# EAGLE design ME433 (EAGLE 9.6.2)
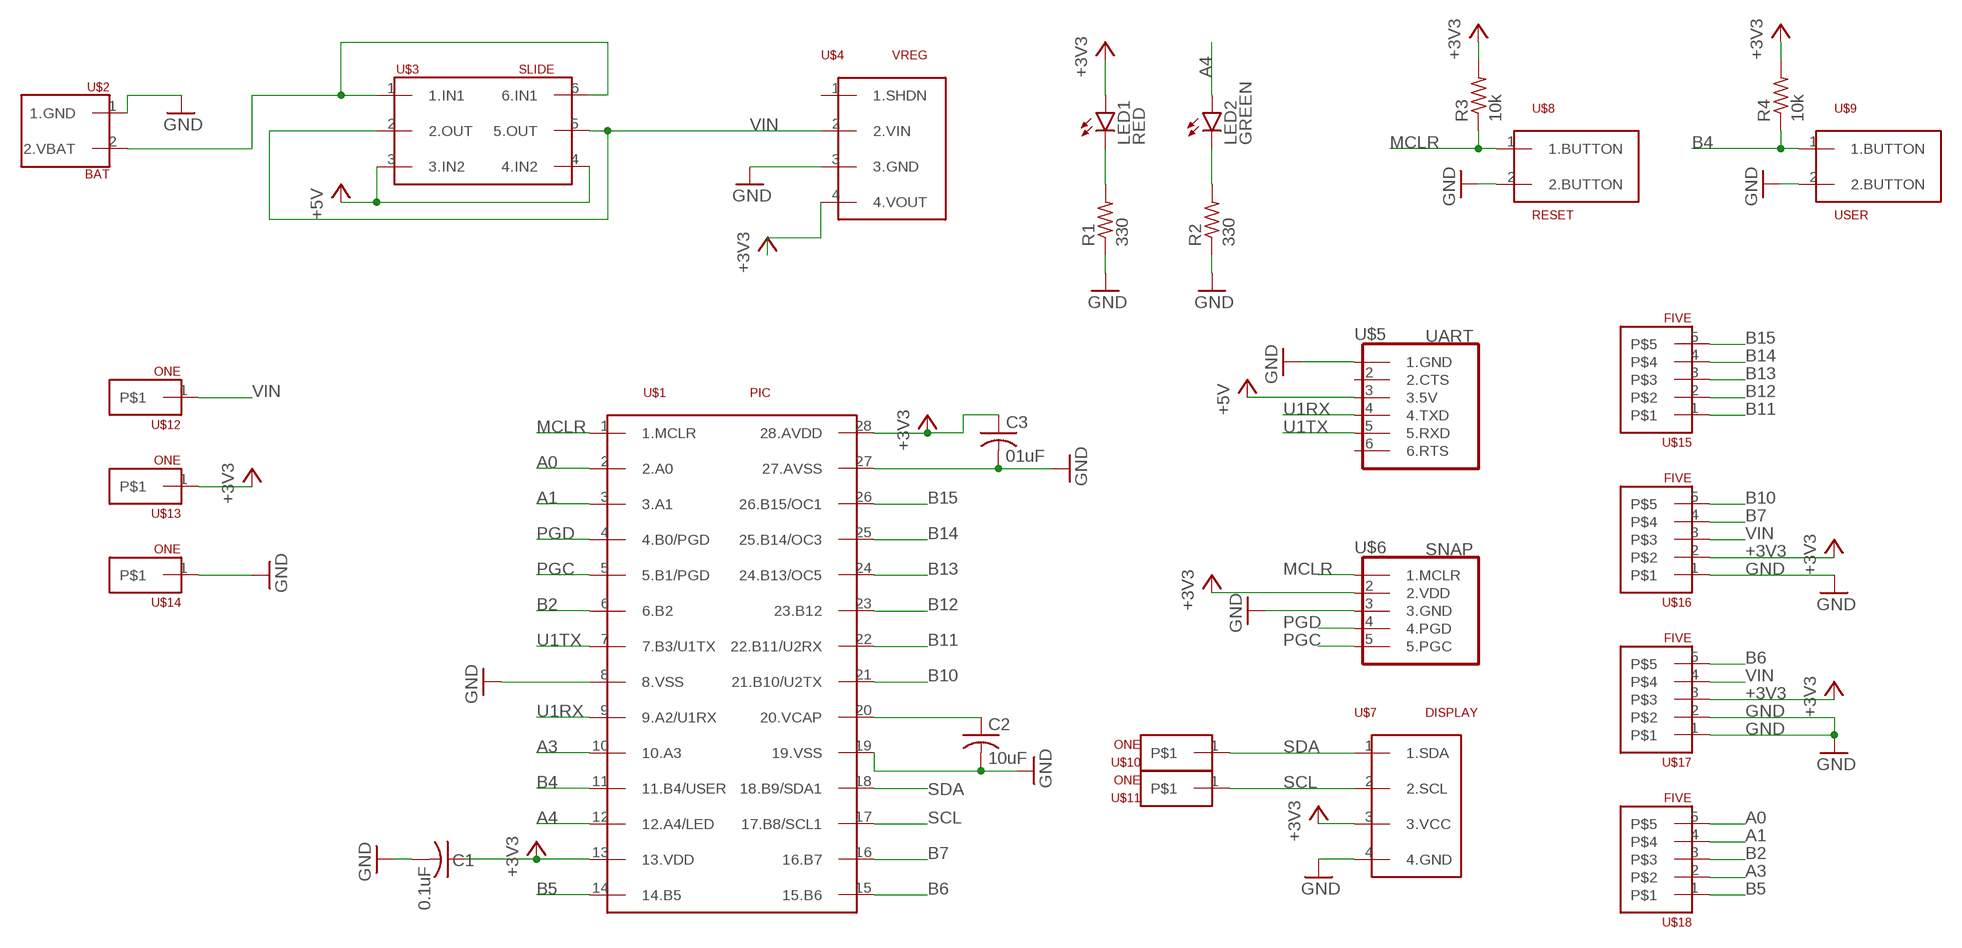
[diagram p0: schematic, sheet 1]

## Parts
C1  0.1uF  C-US025-024X044  [C025-024X044]
C2  10uF  C-US025-024X044  [C025-024X044]
C3  01uF  C-US025-024X044  [C025-024X044]
LED1  RED  LED3MM  [LED3MM]
LED2  GREEN  LED3MM  [LED3MM]
R1  330  R-US_0207/7  [0207/7]
R2  330  R-US_0207/7  [0207/7]
R3  10k  R-US_0207/7  [0207/7]
R4  10k  R-US_0207/7  [0207/7]
U$1  PIC  [DIL28-3]
U$2  BAT  [BAT]
U$3  SLIDE  [SLIDE]
U$4  VREG  [VREG]
U$5  UART  [UART]
U$6  SNAP  [SNAP]
U$7  DISPLAY  [DISPLAY]
U$8  RESET  BUTTON  [BUTTON]
U$9  USER  BUTTON  [BUTTON]
U$10  ONE  [ONE]
U$11  ONE  [ONE]
U$12  ONE  [ONE]
U$13  ONE  [ONE]
U$14  ONE  [ONE]
U$15  FIVE  [FIVE]
U$16  FIVE  [FIVE]
U$17  FIVE  [FIVE]
U$18  FIVE  [FIVE]

## Nets
+3V3: C1.1 C3.1 LED1.A R3.2 R4.2 U$1.13(13.VDD) U$1.28(28.AVDD) U$4.4(4.VOUT) U$6.2(2.VDD) U$7.3(3.VCC) U$13.1 U$16.2 U$17.3
+5V: U$3.3(3.IN2) U$3.4(4.IN2) U$5.3(3.5V)
A0: U$1.2(2.A0) U$18.5
A1: U$1.3(3.A1) U$18.4
A3: U$1.10(10.A3) U$18.2
A4: LED2.A U$1.12(12.A4/LED)
B2: U$1.6(6.B2) U$18.3
B4: R4.1 U$1.11(11.B4/USER) U$9.1(1.BUTTON)
B5: U$1.14(14.B5) U$18.1
B6: U$1.15(15.B6) U$17.5
B7: U$1.16(16.B7) U$16.4
B10: U$1.21(21.B10/U2TX) U$16.5
B11: U$1.22(22.B11/U2RX) U$15.1
B12: U$1.23(23.B12) U$15.2
B13: U$1.24(24.B13/OC5) U$15.3
B14: U$1.25(25.B14/OC3) U$15.4
B15: U$1.26(26.B15/OC1) U$15.5
GND: C1.2 C2.2 C3.2 R1.1 R2.1 U$1.8(8.VSS) U$1.19(19.VSS) U$1.27(27.AVSS) U$2.1(1.GND) U$4.3(3.GND) U$5.1(1.GND) U$6.3(3.GND) U$7.4(4.GND) U$8.2(2.BUTTON) U$9.2(2.BUTTON) U$14.1 U$16.1 U$17.1 U$17.2
MCLR: R3.1 U$1.1(1.MCLR) U$6.1(1.MCLR) U$8.1(1.BUTTON)
N$1: LED1.K(C) R1.2
N$2: U$2.2(2.VBAT) U$3.1(1.IN1) U$3.6(6.IN1)
N$3: C2.1 U$1.20(20.VCAP)
N$5: LED2.K(C) R2.2
PGC: U$1.5(5.B1/PGD) U$6.5(5.PGC)
PGD: U$1.4(4.B0/PGD) U$6.4(4.PGD)
SCL: U$1.17(17.B8/SCL1) U$7.2(2.SCL) U$11.1
SDA: U$1.18(18.B9/SDA1) U$7.1(1.SDA) U$10.1
U1RX: U$1.9(9.A2/U1RX) U$5.4(4.TXD)
U1TX: U$1.7(7.B3/U1TX) U$5.5(5.RXD)
VIN: U$3.2(2.OUT) U$3.5(5.OUT) U$4.2(2.VIN) U$12.1 U$16.3 U$17.4
Unconnected: U$4.1(1.SHDN) U$5.2(2.CTS) U$5.6(6.RTS)

## Library data of the parts
C1-C3 = me433hw4:C-US: CAPACITOR, American symbol; SPICEPREFIX: C
LED1 LED2 = me433hw4:LED: LED OSRAM: - CHIPLED LG R971, LG N971, LY N971, LG Q971, LY Q971, LO R971, LY R971 LH N974, LH R974 LS Q976, LO Q976, LY Q976 LO Q996 - Hyper CHIPLED LW Q18S LB Q993, LB Q99A, LB R99A - SideLED LS A670, LO A670, LY A670, LG A670, LP A670 LB A673, LV A673, LT A673, LW A673 LH A674 LY A675 LS A676, LA A676, LO A676, LY A676, LW A676 LS A679, LY A679, LG A679 - Hyper Micro SIDELED® LS Y876, LA Y876, LO Y876, LY Y876 LT Y87S - SmartLED LW L88C, LW L88S LB L89C, LB L89S, LG L890 LS L89K, LO L89K, LY L89K LS L896, LA L896, LO L896, LY L896 - TOPLED LS T670, LO T670, LY T670, LG T670, LP T670 LSG T670, LSP T670, LSY T670, LOP T670, LYG T670 LG T671, LOG T671, LSG T671 LB T673, LV T673, LT T673, LW T673 LH T674 LS T676, LA T676, LO T676, LY T676, LB T676, LH T676, LSB T676, LW T676 LB T67C, LV T67C, LT T67C, LS T67K, LO T67K, LY T67K, LW E67C LS E67B, LA E67B, LO E67B, LY E67B, LB E67C, LV E67C, LT E67C LW T67C LS T679, LY T679, LG T679 LS T770, LO T770, LY T770, LG T770, LP T770 LB T773, LV T773, LT T773, LW T773 LH T774 LS E675, LA E675, LY E675, LS T675 LS T776, LA T776, LO T776, LY T776, LB T776 LHGB T686 LT T68C, LB T68C - Hyper Mini TOPLED® LB M676 - Mini TOPLED Santana® LG M470 LS M47K, LO M47K, LY M47K Source: http://www.osram.convergy.de LUXEON: - LUMILED® LXK2-PW12-R00, LXK2-PW12-S00, LXK2-PW14-U00, LXK2-PW14-V00 LXK2-PM12-R00, LXK2-PM12-S00, LXK2-PM14-U00 LXK2-PE12-Q00, LXK2-PE12-R00, LXK2-PE12-S00, LXK2-PE14-T00, LXK2-PE14-U00 LXK2-PB12-K00, LXK2-PB12-L00, LXK2-PB12-M00, LXK2-PB14-N00, LXK2-PB14-P00, LXK2-PB14-Q00 LXK2-PR12-L00, LXK2-PR12-M00, LXK2-PR14-Q00, LXK2-PR14-R00 LXK2-PD12-Q00, LXK2-PD12-R00, LXK2-PD12-S00 LXK2-PH12-R00, LXK2-PH12-S00 LXK2-PL12-P00, LXK2-PL12-Q00, LXK2-PL12-R00 Source: www.luxeon.com KINGBRIGHT: KA-3528ASYC Source: www.kingbright.com
R1-R4 = me433hw4:R-US_: RESISTOR, American symbol; SPICEPREFIX: R
U$1 = me433hw4:PIC
U$2 = me433hw4:BAT
U$3 = me433hw4:SLIDE
U$4 = me433hw4:VREG
U$5 = me433hw4:UART
U$6 = me433hw4:SNAP
U$7 = me433hw4:DISPLAY
U$8 U$9 = me433hw4:BUTTON
U$10-U$14 = me433hw4:ONE
U$15-U$18 = me433hw4:FIVE

## Board
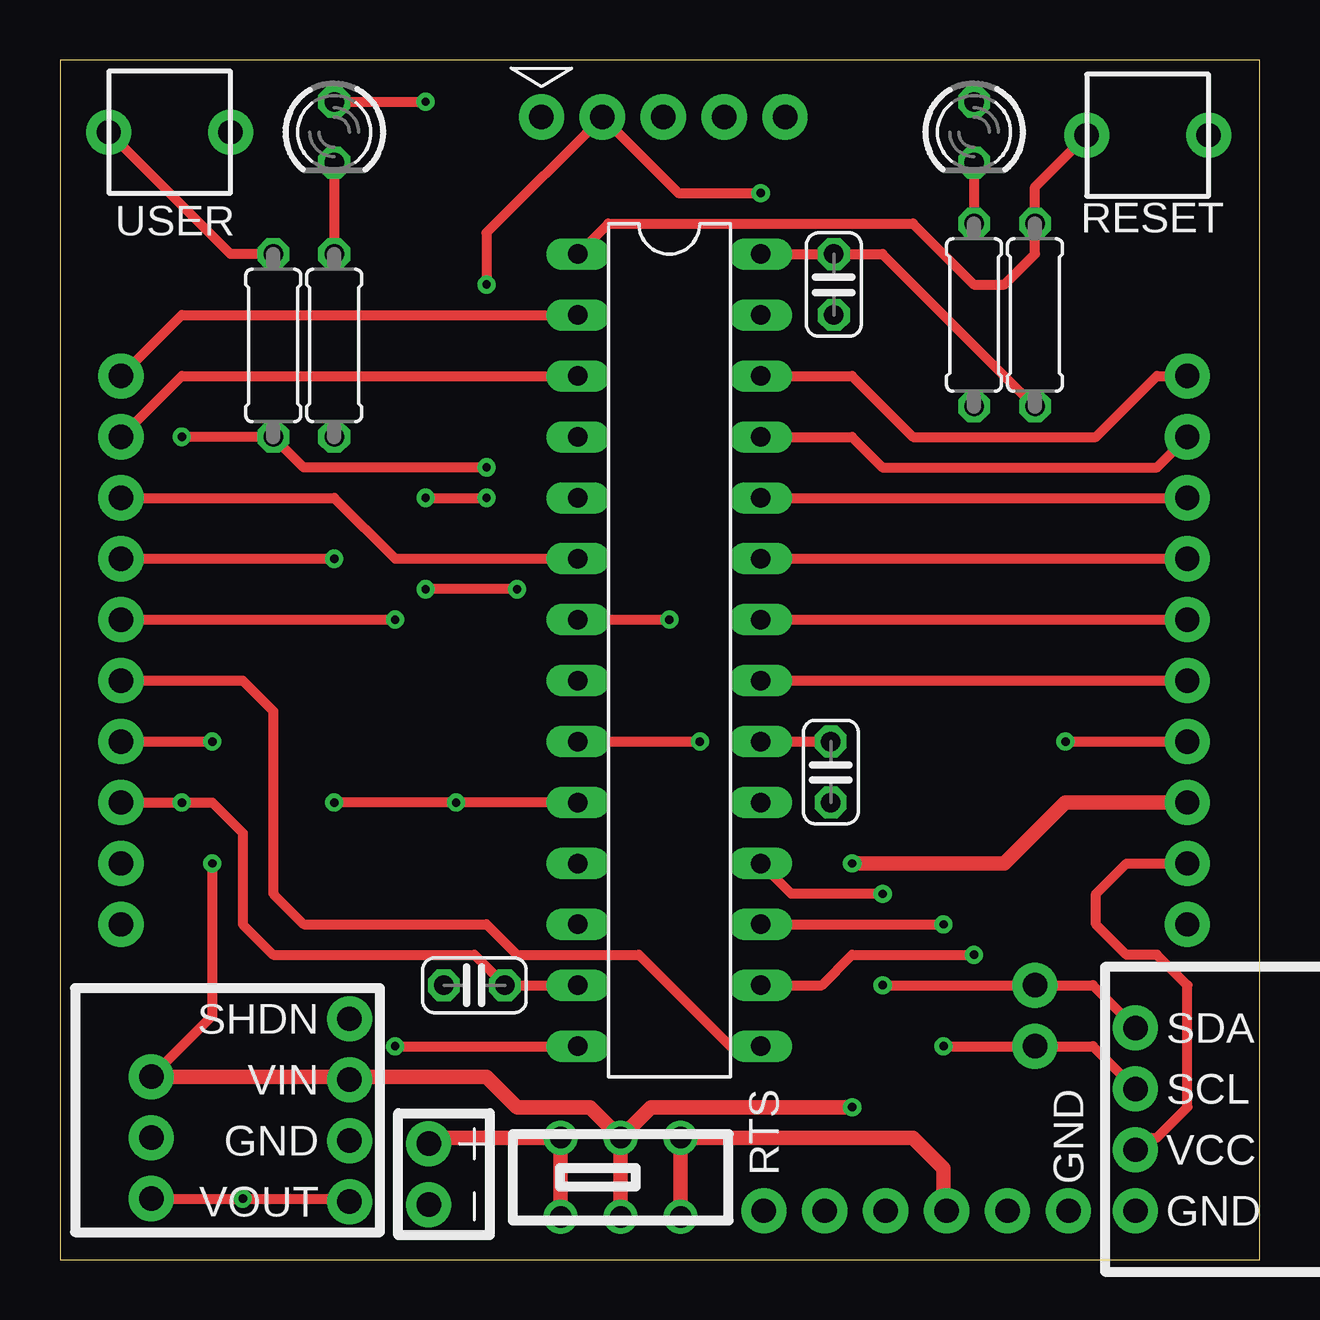
[diagram p1: board, top side]
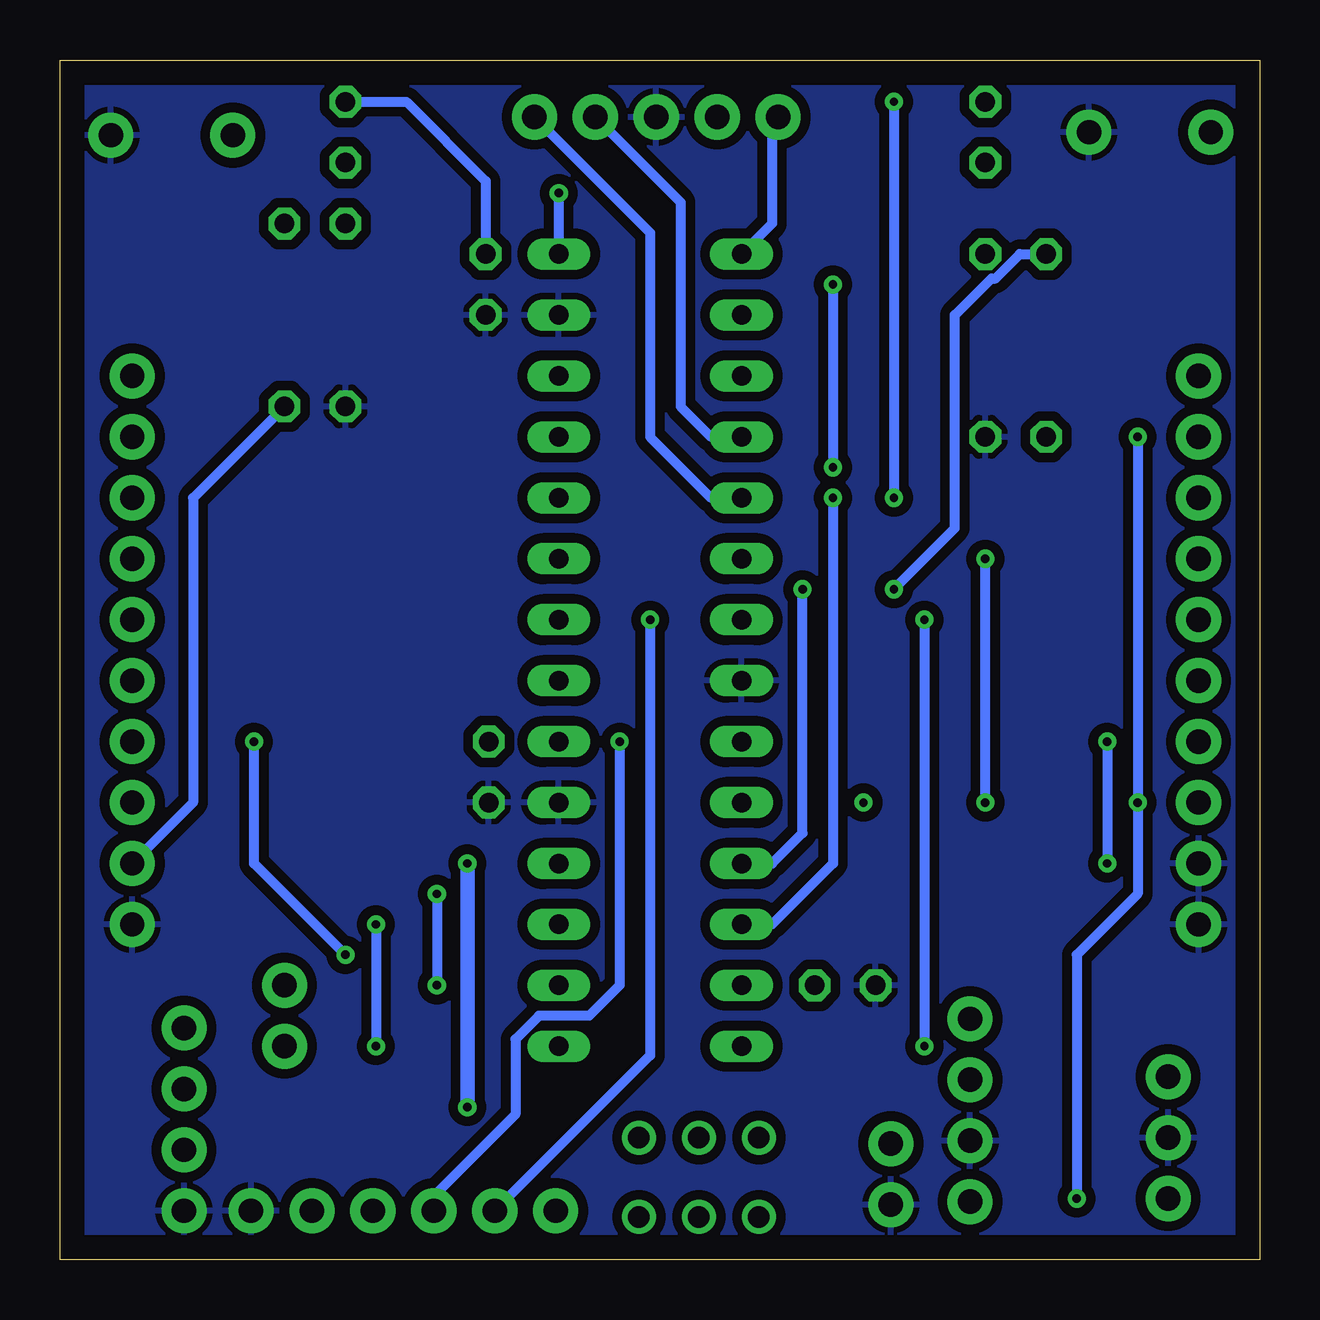
[diagram p2: board, bottom side, seen from below]

Size 50 x 50 mm. Coordinates in mm from the lower left corner, seen from the top.
Outline: 0,0 50,0 50,50 0,50 0,0
Copper layers (1*16): Top 0.035mm / dielectric 1.5mm / Bottom 0.035mm
Design rules "default": minimum track width 6mil, minimum drill 0.35mm, track to track 6mil, track to pad 6mil, pad to pad 6mil, via to via 6mil, smd to smd 6mil, copper to edge 40mil, drill to drill 6mil, minimum pad ring 10mil, minimum via ring 8mil, stop-mask expansion 4mil, vias tented up to drill 0mil, thermal gap 10mil

### Footprints (pad centres in the part's own frame; a part is rotated, then mirrored left to right if it is on the bottom)
C025-024X044 = drill 0.813 octagon: 1 -1.27,0; 2 1.27,0
LED3MM = drill 0.813 octagon: A -1.27,0; K 1.27,0
0207/7 = drill 0.813 octagon: 1 -3.81,0; 2 3.81,0
DIL28-3 = drill 0.813 long: 1 -16.51,-3.81; 2 -13.97,-3.81; 3 -11.43,-3.81; 4 -8.89,-3.81; 5 -6.35,-3.81; 6 -3.81,-3.81; 7 -1.27,-3.81; 8 1.27,-3.81; 9 3.81,-3.81; 10 6.35,-3.81; 11 8.89,-3.81; 12 11.43,-3.81; 13 13.97,-3.81; 14 16.51,-3.81; 15 16.51,3.81; 16 13.97,3.81; 17 11.43,3.81; 18 8.89,3.81; 19 6.35,3.81; 20 3.81,3.81; 21 1.27,3.81; 22 -1.27,3.81; 23 -3.81,3.81; 24 -6.35,3.81; 25 -8.89,3.81; 26 -11.43,3.81; 27 -13.97,3.81; 28 -16.51,3.81
BAT = drill 1.016 pad 1.88: 1 -1.27,0; 2 1.27,0
SLIDE = drill 0.9: 1 -2.5,-1.65; 2 0,-1.65; 3 2.5,-1.65; 4 2.5,1.65; 5 0,1.65; 6 -2.5,1.65
VREG = drill 1.016 pad 1.88: 1 3.81,0; 2 1.27,0; 3 -1.27,0; 4 -3.81,0
UART = drill 1.016 pad 1.88: 1 -6.35,0; 2 -3.81,0; 3 -1.27,0; 4 1.27,0; 5 3.81,0; 6 6.35,0
SNAP = drill 1.016 pad 1.88: 1 -5.08,0; 2 -2.54,0; 3 0,0; 4 2.54,0; 5 5.08,0
DISPLAY = drill 1.016 pad 1.88: 1 0,3.81; 2 0,1.27; 3 0,-1.27; 4 0,-3.81
BUTTON = drill 1.016 pad 1.88: 1 0,0; 2 5.08,0
ONE = drill 1.016 pad 1.88: 1 0,0
FIVE = drill 1.016 pad 1.88: 1 -5.08,0; 2 -2.54,0; 3 0,0; 4 2.54,0; 5 5.08,0

### Placement (x,y rotation side)
C1  17.27,11.43 180 top
C2  32.13,20.32 270 top
C3  32.26,40.64 270 top
LED1  38.1,46.99 270 top
LED2  11.43,46.99 270 top
R1  38.1,39.37 90 top
R2  11.43,38.1 90 top
R3  40.64,39.37 270 top
R4  8.89,38.1 270 top
U$1  25.4,25.4 270 top
U$2  15.37,3.56 90 top
U$3  23.37,3.43 0 top
U$4  12.06,6.22 90 top
U$5  35.69,2.03 180 top
U$6  25.15,47.62 0 top
U$7  44.83,5.84 0 top
U$8  42.8,46.86 0 top
U$9  2.03,46.99 0 top
U$10  40.64,11.43 0 top
U$11  40.64,8.89 0 top
U$12  3.81,7.62 0 top
U$13  3.81,2.54 0 top
U$14  3.81,5.08 0 top
U$15  46.99,31.75 90 top
U$16  46.99,19.05 90 top
U$17  2.54,19.05 90 top
U$18  2.54,31.75 90 top

### Tracks (layer width: path | path; a pad name or v marks a point on that pad's centre or on a via)
+3V3  (via drill 0.35)
  Top 0.406: U$1.28 C3.1 34.29,41.91 R3.2 | U$7.3 45.34,5.08 45.72,5.08 46.99,6.35 46.99,11.43 45.72,12.7 44.45,12.7 43.18,13.97 43.18,15.24 44.45,16.51 U$16.2 | U$13.1 v7.62,2.54 11.94,2.54 U$4.4 | U$1.13 C1.1 17.27,12.7 8.89,12.7 7.62,13.97 7.62,17.78 6.35,19.05 v5.08,19.05 U$17.3 | v29.21,44.45 25.78,44.45 U$6.2 17.78,42.8 v17.78,40.64 | v17.78,33.02 10.16,33.02 R4.2 v5.08,34.29
  Bottom 0.406: LED1.A 35.56,48.26 32.26,44.96 C3.1 | U$6.2 22.86,47.37 | v7.62,2.54 7.62,12.7 5.08,15.24 v5.08,19.05 v5.08,34.29 | R3.2 44.45,31.75 44.45,19.05 U$16.2 | v29.21,44.45 U$1.28 | v17.78,40.64 v17.78,33.02
+5V
  Top 0.61: U$3.3 U$3.4 35.56,5.08 36.83,3.81 36.83,2.16 U$5.3
A0
  Top 0.406: U$18.5 5.08,39.37 U$1.2
A1
  Top 0.406: U$18.4 5.08,36.83 U$1.3
A3  (via drill 0.35)
  Top 0.406: U$18.2 v11.43,29.21 | U$1.10 v16.51,19.05 v11.43,19.05
  Bottom 0.406: v11.43,19.05 v11.43,29.21
A4  (via drill 0.35)
  Top 0.406: LED2.A v15.24,48.26 | v15.24,31.75 v17.78,31.75
  Bottom 0.406: v15.24,48.26 v15.24,31.75 | v17.78,31.75 17.78,16.51 20.32,13.97 U$1.12
B2
  Top 0.406: U$18.3 11.43,31.75 13.97,29.21 U$1.6
B4  (via drill 0.35)
  Top 0.406: R4.1 7.11,41.91 U$9.1 | v19.05,27.94 v15.24,27.94
  Bottom 0.406: U$1.11 20.32,16.51 19.05,17.78 v19.05,27.94 | v15.24,27.94 12.7,30.48 12.7,39.37 11.18,40.89 11.01,40.89 9.99,41.91 R4.1
B5  (via drill 0.35)
  Top 0.406: U$18.1 v13.97,26.67 | v13.97,8.89 U$1.14
  Bottom 0.406: v13.97,26.67 v13.97,8.89
B6
  Top 0.406: U$17.5 7.62,24.13 8.89,22.86 8.89,15.24 10.16,13.97 17.78,13.97 19.05,12.7 24.13,12.7 27.94,8.89 U$1.15
B7  (via drill 0.35)
  Top 0.406: U$1.16 31.75,11.43 33.02,12.7 v38.1,12.7 | v41.91,21.59 U$16.4
  Bottom 0.406: v38.1,12.7 41.91,16.51 v41.91,21.59
B10
  Top 0.406: U$1.21 U$16.5
B11
  Top 0.406: U$1.22 U$15.1
B12
  Top 0.406: U$1.23 U$15.2
B13
  Top 0.406: U$1.24 U$15.3
B14
  Top 0.406: U$1.25 33.02,34.29 34.29,33.02 45.72,33.02 U$15.4
B15
  Top 0.406: U$1.26 33.02,36.83 35.56,34.29 43.18,34.29 45.72,36.83 U$15.5
GND
  pour Bottom (isolate 0.406): 0,0 50.8,0 50.8,50.8 0,50.8
MCLR
  Top 0.406: U$8.1 40.64,44.7 R3.1 40.64,41.91 39.37,40.64 38.1,40.64 35.56,43.18 22.86,43.18 U$1.1
  Bottom 0.406: U$6.1 20.32,47.37 20.32,43.18 U$1.1
N$1
  Top 0.406: LED1.K R1.2
N$2
  Top 0.61: U$3.1 U$3.6 15.62,5.08 U$2.2
N$3
  Top 0.406: U$1.20 C2.1
N$5
  Top 0.406: LED2.K R2.2
PGC
  Bottom 0.406: U$1.5 22.86,31.75 25.4,34.29 25.4,42.8 U$6.5
PGD
  Bottom 0.406: U$1.4 22.86,34.29 24.13,35.56 24.13,44.07 U$6.4
SCL  (via drill 0.35)
  Top 0.406: U$1.17 v36.83,13.97 | v36.83,8.89 U$11.1 43.05,8.89 U$7.2
  Bottom 0.406: v36.83,13.97 v36.83,8.89
SDA  (via drill 0.35)
  Top 0.406: U$1.18 30.48,15.24 v34.29,15.24 | v34.29,11.43 U$10.1 43.05,11.43 U$7.1
  Bottom 0.406: v34.29,15.24 v34.29,11.43
U1RX  (via drill 0.35)
  Top 0.406: U$1.9 v26.67,21.59
  Bottom 0.406: v26.67,21.59 26.67,11.43 27.94,10.16 30.04,10.16 31.02,9.18 31.02,6.05 34.42,2.65 U$5.4
U1TX  (via drill 0.35)
  Top 0.406: U$1.7 v25.4,26.67
  Bottom 0.406: U$5.5 25.4,8.51 v25.4,26.67
VIN  (via drill 0.35)
  Top 0.406: U$17.4 v6.35,21.59 | v6.35,16.51 6.35,10.16 U$12.1
  Top 0.61: U$3.5 U$3.2 | U$3.5 22.1,6.35 19.05,6.35 17.78,7.62 12.19,7.62 | 12.19,7.62 U$4.2 | U$3.5 24.64,6.35 v33.02,6.35 | v33.02,16.51 39.37,16.51 41.91,19.05 U$16.3 | U$12.1 12.19,7.62
  Bottom 0.406: v6.35,21.59 v6.35,16.51
  Bottom 0.61: v33.02,16.51 v33.02,6.35